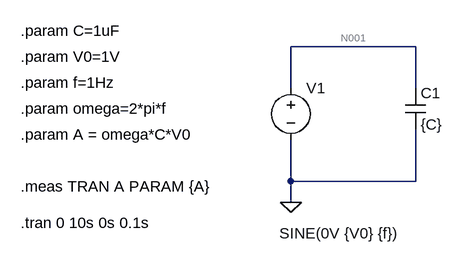
[diagram p0: schematic Capacitor_Reactance_V001.asc]
Capacitor_Reactance_V001.asc, the LTspice schematic file:
Version 4
SHEET 1 880 680
WIRE 336 80 144 80
WIRE 144 144 144 80
WIRE 336 144 336 80
WIRE 144 288 144 224
WIRE 336 288 336 208
WIRE 336 288 144 288
WIRE 144 320 144 288
FLAG 144 320 0
SYMBOL voltage 144 128 R0
WINDOW 3 -18 240 Left 2
WINDOW 123 0 0 Left 0
WINDOW 39 0 0 Left 0
SYMATTR InstName V1
SYMATTR Value SINE(0V {V0} {f})
SYMBOL cap 320 144 R0
SYMATTR InstName C1
SYMATTR Value {C}
TEXT -272 352 Left 2 !.tran 0 10s 0s 0.1s
TEXT -272 136 Left 2 !.param f=1Hz
TEXT -272 176 Left 2 !.param omega=2*pi*f
TEXT -272 296 Left 2 !.meas TRAN A PARAM {A}
TEXT -272 216 Left 2 !.param A = omega*C*V0
TEXT -272 96 Left 2 !.param V0=1V
TEXT -272 56 Left 2 !.param C=1uF

The netlist it stands for:
* Capacitor_Reactance_V001.asc
V1 N001 0 SINE(0V {V0} {f})
C1 N001 0 {C}
.tran 0 10s 0s 0.1s
.param f=1Hz
.param omega=2*pi*f
.meas TRAN A PARAM {A}
.param A = omega*C*V0
.param V0=1V
.param C=1uF
.backanno
.end

* Results of the author's LTspice run, read from the files saved beside the schematic
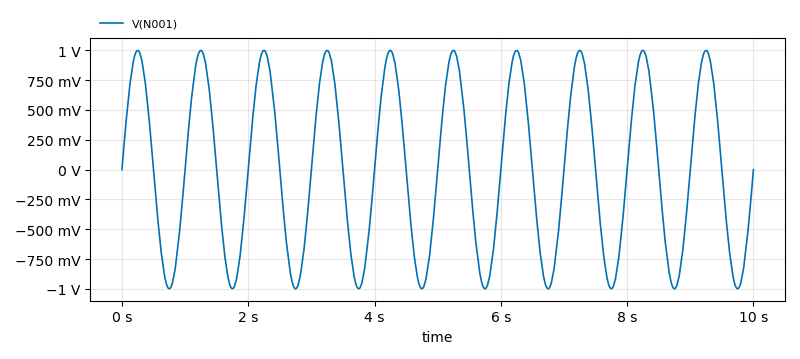
[diagram p1: Transient Analysis of Capacitor_Reactance_V001.asc, plotted from the saved traces]
* Transient Analysis, 1 run:
*   V(N001): min -999.7 mV, max 999.7 mV, average 1.223 µV, rms 708.9 mV, last 0 V
* From the log:
*   a: 6.28318530717959e-006=6.28319e-006